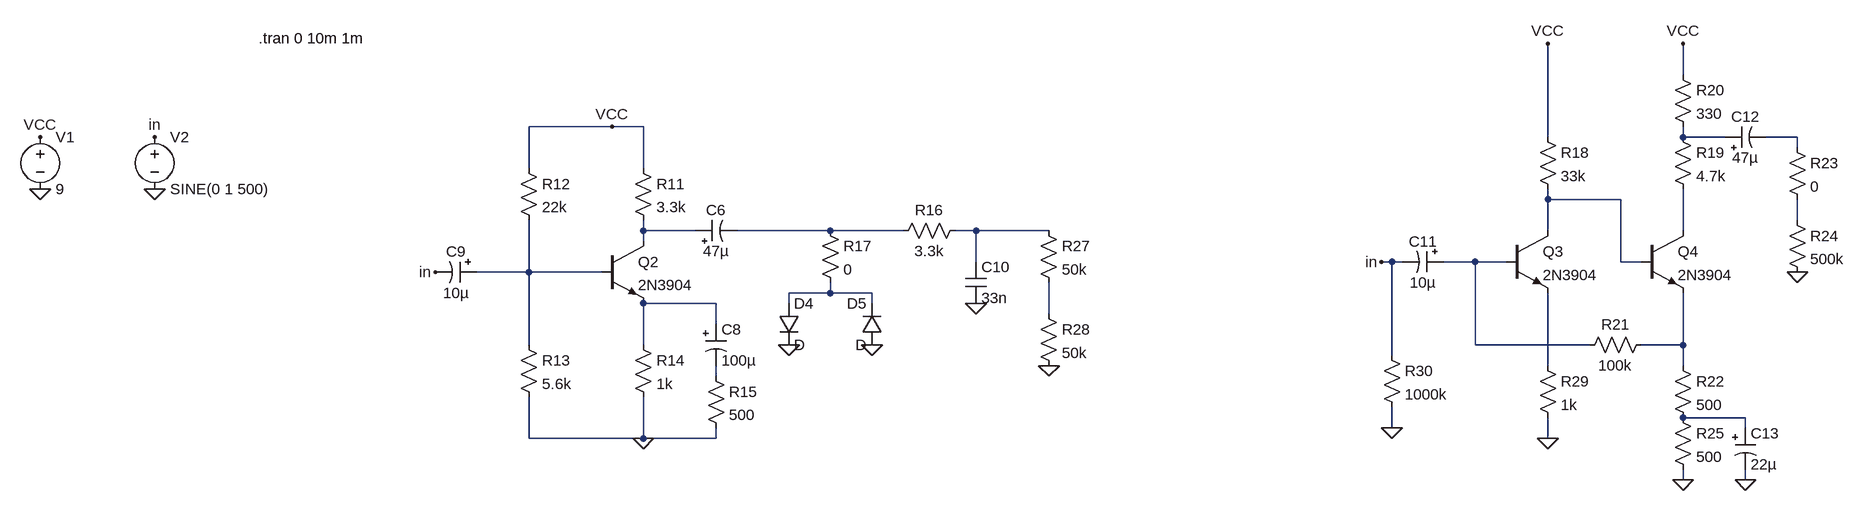
[diagram p0: schematic circuits.asc]
circuits.asc, the LTspice schematic file:
Version 4.1
SHEET 1 3908 1460
WIRE 2384 -144 2384 -192
WIRE 736 -64 608 -64
WIRE 784 -64 736 -64
WIRE 2176 -48 2176 -192
WIRE 2384 -48 2384 -64
WIRE 2448 -48 2384 -48
WIRE 2560 -48 2512 -48
WIRE 2560 -32 2560 -48
WIRE 608 0 608 -64
WIRE 784 0 784 -64
WIRE 2176 48 2176 32
WIRE 2288 48 2176 48
WIRE 2560 80 2560 48
WIRE 784 96 784 80
WIRE 864 96 784 96
WIRE 1072 96 928 96
WIRE 1184 96 1072 96
WIRE 1296 96 1264 96
WIRE 1408 96 1296 96
WIRE 2176 96 2176 48
WIRE 2384 96 2384 32
WIRE 784 112 784 96
WIRE 1296 144 1296 96
WIRE 1936 144 1920 144
WIRE 1952 144 1936 144
WIRE 2064 144 2016 144
WIRE 2112 144 2064 144
WIRE 2288 144 2288 48
WIRE 2320 144 2288 144
WIRE 608 160 608 80
WIRE 608 160 528 160
WIRE 720 160 608 160
WIRE 1072 192 1072 176
WIRE 1072 192 1008 192
WIRE 1136 192 1072 192
WIRE 896 208 784 208
WIRE 1008 208 1008 192
WIRE 1136 208 1136 192
WIRE 1408 224 1408 176
WIRE 896 240 896 208
WIRE 608 272 608 160
WIRE 784 272 784 208
WIRE 2064 272 2064 144
WIRE 2240 272 2064 272
WIRE 2384 272 2384 192
WIRE 2384 272 2320 272
WIRE 1936 288 1936 144
WIRE 2176 304 2176 192
WIRE 2384 304 2384 272
WIRE 896 320 896 304
WIRE 2480 384 2384 384
WIRE 1936 400 1936 368
WIRE 2480 400 2480 384
WIRE 608 416 608 352
WIRE 784 416 784 352
WIRE 784 416 608 416
WIRE 896 416 896 400
WIRE 896 416 784 416
WIRE 2176 416 2176 384
WIRE 2384 480 2384 464
WIRE 2480 480 2480 464
FLAG -144 32 0
FLAG -144 -48 VCC
FLAG 32 32 0
FLAG 32 -48 in
FLAG 784 416 0
FLAG 736 -64 VCC
FLAG 464 160 in
FLAG 1008 272 0
FLAG 1136 272 0
FLAG 1920 144 in
FLAG 2384 480 0
FLAG 2560 160 0
FLAG 2176 -192 VCC
FLAG 2384 -192 VCC
FLAG 2480 480 0
FLAG 1296 208 0
FLAG 1408 304 0
FLAG 2176 416 0
FLAG 1936 400 0
SYMBOL voltage -144 -64 R0
WINDOW 123 0 0 Left 0
WINDOW 39 0 0 Left 0
SYMATTR InstName V1
SYMATTR Value 9
SYMBOL voltage 32 -64 R0
WINDOW 123 0 0 Left 0
WINDOW 39 0 0 Left 0
SYMATTR InstName V2
SYMATTR Value SINE(0 1 500)
SYMBOL npn 720 112 R0
SYMATTR InstName Q2
SYMATTR Value 2N3904
SYMBOL res 768 -16 R0
SYMATTR InstName R11
SYMATTR Value 3.3k
SYMBOL res 592 -16 R0
SYMATTR InstName R12
SYMATTR Value 22k
SYMBOL res 592 256 R0
SYMATTR InstName R13
SYMATTR Value 5.6k
SYMBOL res 768 256 R0
SYMATTR InstName R14
SYMATTR Value 1k
SYMBOL polcap 864 112 R270
WINDOW 0 32 32 VTop 2
WINDOW 3 0 32 VBottom 2
SYMATTR InstName C6
SYMATTR Value 47µ
SYMBOL polcap 880 240 R0
SYMATTR InstName C8
SYMATTR Value 100µ
SYMBOL polcap 528 144 R90
WINDOW 0 0 32 VBottom 2
WINDOW 3 32 32 VTop 2
SYMATTR InstName C9
SYMATTR Value 10µ
SYMBOL res 880 304 R0
SYMATTR InstName R15
SYMATTR Value 500
SYMBOL diode 992 208 R0
SYMATTR InstName D4
SYMBOL diode 1152 272 R180
WINDOW 0 24 64 Left 2
WINDOW 3 24 0 Left 2
SYMATTR InstName D5
SYMBOL res 1056 80 R0
SYMATTR InstName R17
SYMATTR Value 0
SYMBOL npn 2112 96 R0
SYMATTR InstName Q3
SYMATTR Value 2N3904
SYMBOL npn 2320 96 R0
SYMATTR InstName Q4
SYMATTR Value 2N3904
SYMBOL res 2160 -64 R0
SYMATTR InstName R18
SYMATTR Value 33k
SYMBOL res 2368 -64 R0
SYMATTR InstName R19
SYMATTR Value 4.7k
SYMBOL res 2336 256 R90
WINDOW 0 0 56 VBottom 2
WINDOW 3 32 56 VTop 2
SYMATTR InstName R21
SYMATTR Value 100k
SYMBOL res 2368 -160 R0
SYMATTR InstName R20
SYMATTR Value 330
SYMBOL res 2544 -48 R0
SYMATTR InstName R23
SYMATTR Value 0
SYMBOL res 2544 64 R0
SYMATTR InstName R24
SYMATTR Value 500k
SYMBOL res 2368 288 R0
SYMATTR InstName R22
SYMATTR Value 500
SYMBOL res 2368 368 R0
SYMATTR InstName R25
SYMATTR Value 500
SYMBOL polcap 2016 128 R90
WINDOW 0 0 32 VBottom 2
WINDOW 3 32 32 VTop 2
SYMATTR InstName C11
SYMATTR Value 10µ
SYMBOL polcap 2464 400 R0
SYMATTR InstName C13
SYMATTR Value 22µ
SYMBOL res 1280 80 R90
WINDOW 0 0 56 VBottom 2
WINDOW 3 32 56 VTop 2
SYMATTR InstName R16
SYMATTR Value 3.3k
SYMBOL cap 1280 144 R0
SYMATTR InstName C10
SYMATTR Value 33n
SYMBOL res 1392 80 R0
SYMATTR InstName R27
SYMATTR Value 50k
SYMBOL res 1392 208 R0
SYMATTR InstName R28
SYMATTR Value 50k
SYMBOL res 2160 288 R0
SYMATTR InstName R29
SYMATTR Value 1k
SYMBOL res 1920 272 R0
SYMATTR InstName R30
SYMATTR Value 1000k
SYMBOL polcap 2448 -32 R270
WINDOW 0 32 32 VTop 2
WINDOW 3 0 32 VBottom 2
SYMATTR InstName C12
SYMATTR Value 47µ
TEXT 192 -200 Left 2 !.tran 0 10m 1m

The netlist it stands for:
* circuits.asc
V1 VCC 0 9
V2 in 0 SINE(0 1 500)
Q2 N005 N010 N012 0 2N3904
R11 VCC N005 3.3k
R12 VCC N010 22k
R13 N010 0 5.6k
R14 N012 0 1k
C6 N005 N006 47µ
C8 N012 N016 100µ
C9 N010 in 10µ
R15 N016 0 500
D4 N011 0 D
D5 0 N011 D
R17 N006 N011 0
Q3 N003 N009 N015 0 2N3904
Q4 N008 N003 N014 0 2N3904
R18 VCC N003 33k
R19 N001 N008 4.7k
R21 N014 N009 100k
R20 VCC N001 330
R23 N002 N004 0
R24 N004 0 500k
R22 N014 N017 500
R25 N017 0 500
C11 N009 in 10µ
C13 N017 0 22µ
R16 N007 N006 3.3k
C10 N007 0 33n
R27 N007 N013 50k
R28 N013 0 50k
R29 N015 0 1k
R30 in 0 1000k
C12 N001 N002 47µ
.model D D
.lib standard.dio
.model NPN NPN
.model PNP PNP
.lib standard.bjt
.tran 0 10m 1m
.backanno
.end